# Altium schematic sheet Radio.SchDoc
size B; SheetNumber: 3; SheetTotal: 3
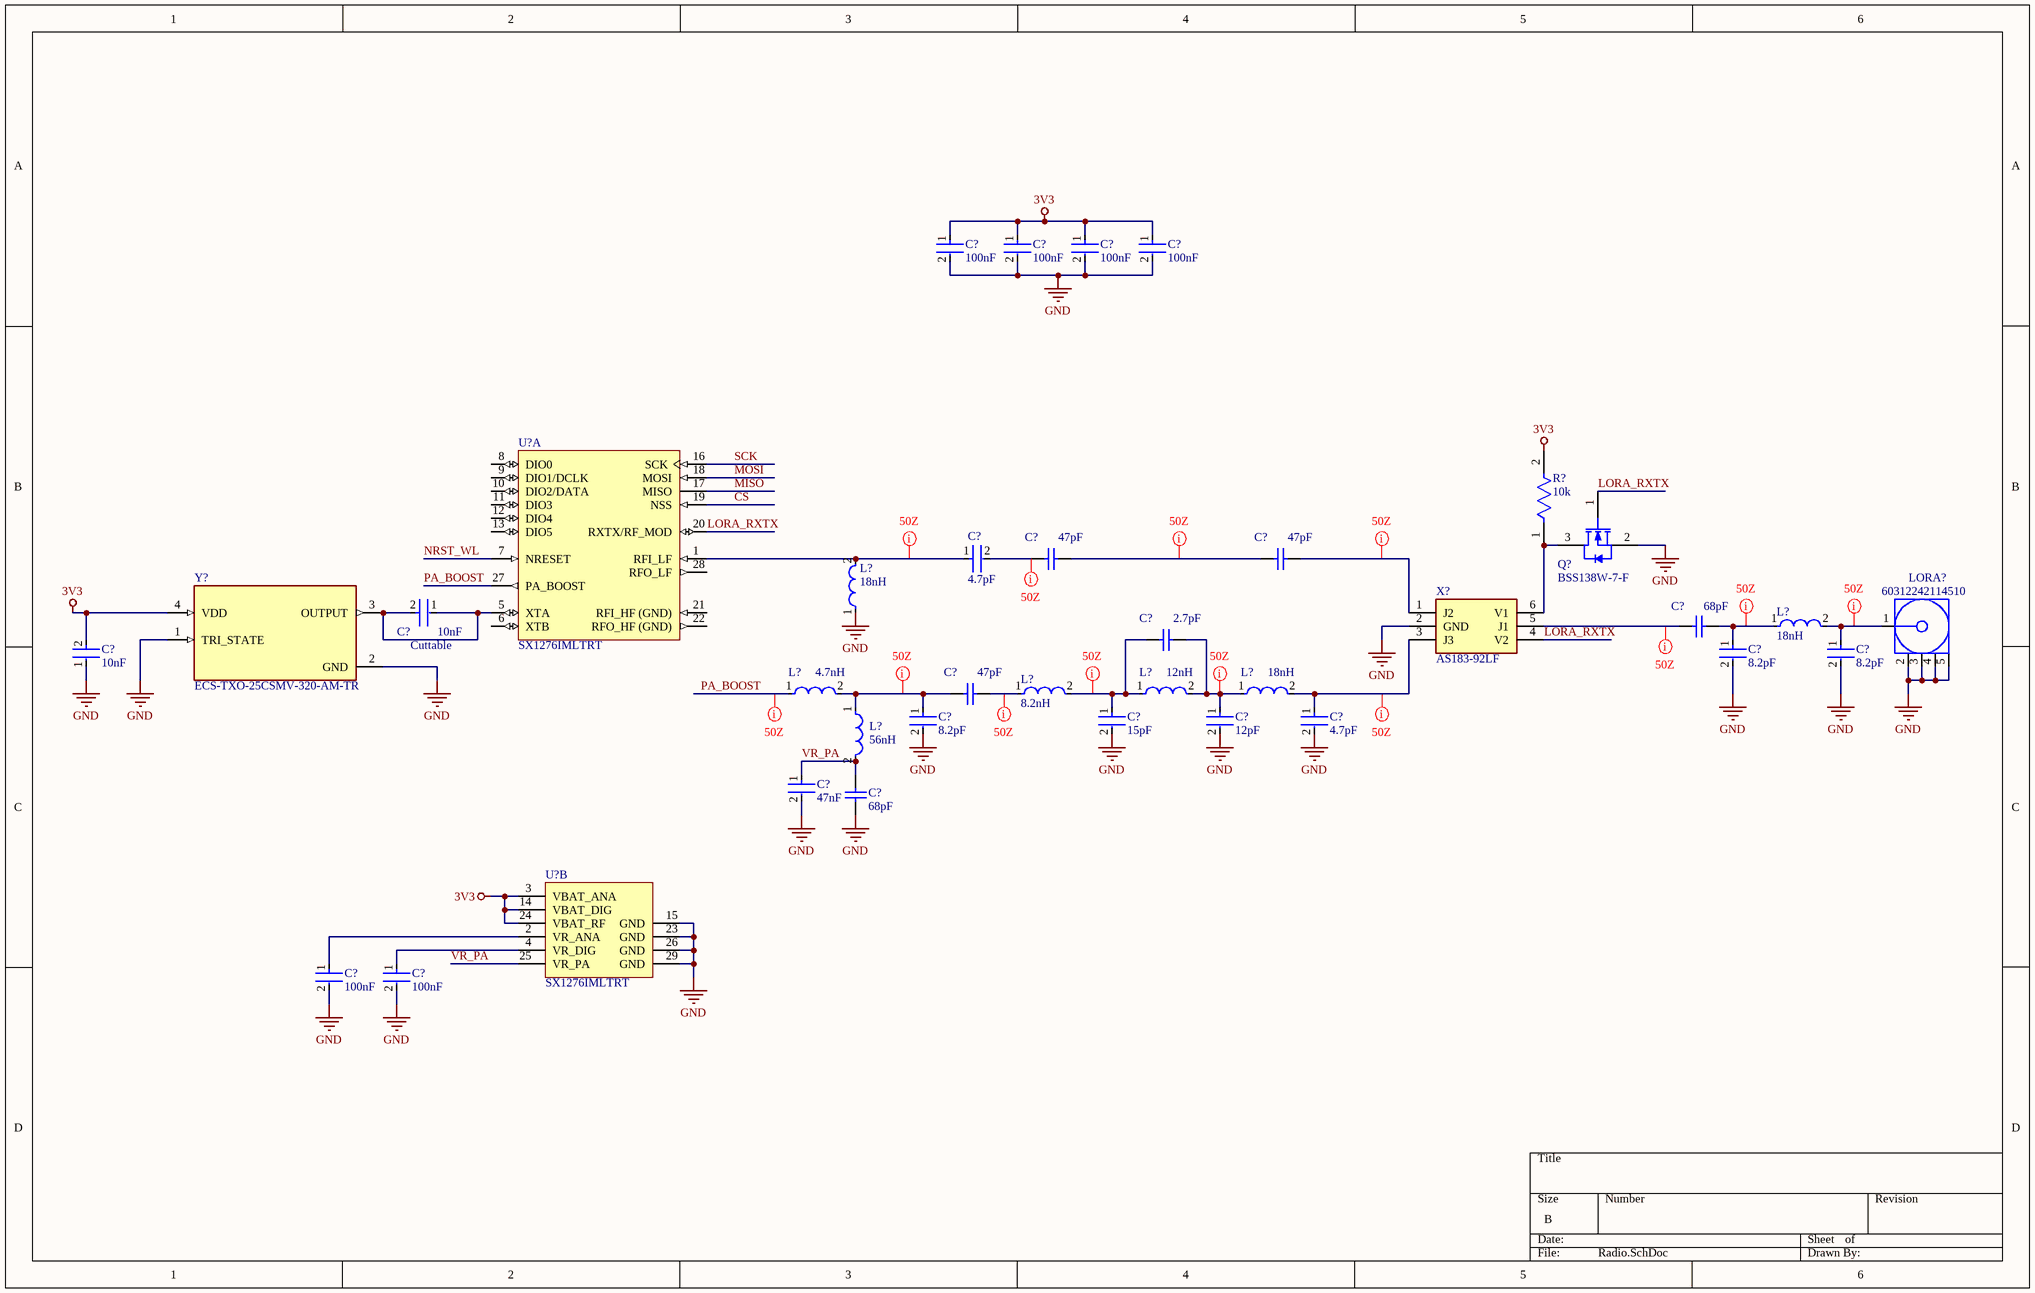
[diagram p0: Radio.SchDoc]

## Parts
(Parts that share a designator on the sheet are numbered #1, #2 ... from top to bottom, then left to right.)
C?#1  100nF  [FP-C0603C-CF-MFG]
C?#2  100nF  [FP-C0603C-CF-MFG]
C?#3  100nF  [FP-C0603C-CF-MFG]
C?#4  100nF  [FP-C0603C-CF-MFG]
C?#5  47pF  [CAPC1005X55X25LL05T10]
C?#6  47pF  [CAPC1005X55X25LL05T10]
C?#7  4.7pF  [FP-GRM155-0_05-MFG]
C?#8  10nF  [FP-C1608-080-0_1-MFG]
C?#9  68pF  [CAPC1005X55X25ML05T10]
C?#10  2.7pF  [CAPC1005X55X25ML05T10]
C?#11  10nF  [FP-C1608-080-0_1-MFG]
C?#12  8.2pF  [FP-GJM155-0_05-MFG]
C?#13  8.2pF  [FP-GJM155-0_05-MFG]
C?#14  47pF  [CAPC1005X55X25LL05T10]
C?#15  8.2pF  [FP-GJM155-0_05-MFG]
C?#16  15pF  [FP-GJM155-0_05-MFG]
C?#17  12pF  [FP-GRM155-0_05-MFG]
C?#18  4.7pF  [FP-GRM155-0_05-MFG]
C?#19  47nF  [FP-GRM155-0_05-IPC_C]
C?#20  68pF  [CAPC1005X55X25ML05T10]
C?#21  100nF  [FP-C0603C-CF-MFG]
C?#22  100nF  [FP-C0603C-CF-MFG]
L?#1  18nH  [FP-LQW15AN_00-W0_6-0_1-MFG]
L?#2  18nH  [FP-LQW15AN_00-W0_6-0_1-MFG]
L?#3  4.7nH  [FP-LQW15AN_00-W0_6-0_1-MFG]
L?#4  8.2nH  [FP-LQW15AN_00-W0_6-0_1-MFG]
L?#5  12nH  [FP-LQW15AN_00-W0_6-0_1-MFG]
L?#6  18nH  [FP-LQW15AN_00-W0_6-0_1-MFG]
L?#7  56nH  [FP-LQW15AN_80-MFG]
LORA?  60312242114510  [60312242114510]
Q?  BSS138W-7-F  [DIOD-SOT323-3_V]
R?  10k  [FP-RT0603-MFG]
U?#1  SX1276IMLTRT  [SMTC-QFN-28_V]  (part A of 2)
U?#2  SX1276IMLTRT  [SMTC-QFN-28_V]  (part B of 2)
X?  AS183-92LF  [SOT65P220X110-6N]
Y?  ECS-TXO-25CSMV-320-AM-TR  [OSC_ECS-2520S25-250-FN-TR]

## Nets
3V3: C?#1.1 C?#2.1 C?#3.1 C?#4.1 C?#11.2 R?.2 U?#2.3(VBAT_ANA) U?#2.14(VBAT_DIG) U?#2.24(VBAT_RF) Y?.4(VDD)
GND: C?#1.2 C?#2.2 C?#3.2 C?#4.2 C?#11.1 C?#12.2 C?#13.2 C?#15.2 C?#16.2 C?#17.2 C?#18.2 C?#19.2 C?#20.1 C?#21.2 C?#22.2 L?#1.1 LORA?.2(GND) LORA?.3(GND) LORA?.4(GND) LORA?.5(GND) Q?.2(S) U?#2.15(GND) U?#2.23(GND) U?#2.26(GND) U?#2.29(GND) X?.2(GND) Y?.1(TRI_STATE) Y?.2(GND)
CS: U?#1.19(NSS)
LORA_RXTX: Q?.1(G) U?#1.20(RXTX/RF_MOD) X?.4(V2)
MISO: U?#1.17(MISO)
MOSI: U?#1.18(MOSI)
NRST_WL: U?#1.7(NRESET)
PA_BOOST: L?#3.1 U?#1.27(PA_BOOST)
SCK: U?#1.16(SCK)
VR_PA: C?#19.1 C?#20.2 L?#7.2 U?#2.25(VR_PA)
NetC?#5_1: C?#5.1 C?#7.2
NetC?#5_2: C?#5.2 C?#6.1
NetC?#6_2: C?#6.2 X?.1(J2)
NetC?#7_1: C?#7.1 L?#1.2 U?#1.1(RFI_LF)
NetC?#8_1: C?#8.1 C?#8.2 U?#1.5(XTA) Y?.3(OUTPUT)
NetC?#9_1: C?#9.1 X?.5(J1)
NetC?#9_2: C?#9.2 C?#12.1 L?#2.1
NetC?#10_1: C?#10.1 C?#16.1 L?#4.2 L?#5.1
NetC?#10_2: C?#10.2 C?#17.1 L?#5.2 L?#6.1
NetC?#13_1: C?#13.1 L?#2.2 LORA?.1(Signal)
NetC?#14_1: C?#14.1 C?#15.1 L?#3.2 L?#7.1
NetC?#14_2: C?#14.2 L?#4.1
NetC?#18_1: C?#18.1 L?#6.2 X?.3(J3)
NetC?#21_1: C?#21.1 U?#2.2(VR_ANA)
NetC?#22_1: C?#22.1 U?#2.4(VR_DIG)
NetQ?_3: Q?.3(D) R?.1 X?.6(V1)

Not connected (* = marked no-connect by the designer): U?#1 6(XTB) 8(DIO0) 9(DIO1/DCLK) 10(DIO2/DATA) 11(DIO3) 12(DIO4) 13(DIO5) 21(RFI_HF_(GND)) 22(RFO_HF_(GND)) 28(RFO_LF)

## Layout directives
net class 50Z; rule Width Constraint [Pref Impedance = 50.00ohms    Min Impedance = 50.00ohms    Max Impedance = 50.00ohms]: NetC?#5_1, NetC?#5_2, NetC?#6_2, NetC?#7_1, NetC?#9_1, NetC?#9_2, NetC?#10_1, NetC?#10_2, NetC?#13_1, NetC?#14_1, NetC?#14_2, NetC?#18_1, PA_BOOST

## Notes on the sheet
- (near C?#8) Cuttable

## Library data of the parts
C?#1-C?#4 C?#21 C?#22 = CMP-2006-03061-2: CAP CER 0.1UF 50V X7R 0603; Manufacturer: KEMET; Manufacturer Part Number: C0603C104K5RACTU; Tolerance: 0.1; Temperature Coefficient: 30ppm/°C; Material: Ceramic; Automotive Grade: Grade 1; Value: 0.10 μF; Temperature: -55°C to +125°C; RoHS: TRUE; Temperature Range High: +125°C; Lead Free: Yes; Octopart: https://octopart.com/c0603c104k5ractu-kemet-139244; Digikey Description: CAP CER 0.1UF 50V X7R 0603; Category: Cap; Package: C0603C-CF; ComponentLink2Description: Datasheet; Temperature Range Low: -55°C; Device Class L1: Passive Components; Voltage Rating: 50 V; Automotive: Yes; Device Class L3: Ceramic Capacitors; ComponentLink2URL: https://api.kemet.com/component-edge/download/datasheet/C0603C100J5GACAUTO.pdf; Capacitance: 0.10 μF; Device Class L2: Capacitors; Temperature Characteristic: X7R; Height: 0.87mm
C?#5 C?#6 C?#14 = CMP-2008-04367-1: Part Number: GRM1555C1H470GA01J; Manufacturer: Murata
C?#7 C?#18 = CMP-2008-04380-2: CAP CER 4.7PF 50V C0G/NP0 0402; Dielectric: C0G; Material: Ceramic; Packaging: Tape and Reel; RoHS Compliant: Yes; Package Quantity: 1; Min Operating Temperature: -55°C; Voltage Rating (DC): 50V; Radiation Hardening: No; Thickness: 0.022inch; Case Code (Imperial): 0402; Length: 1mm; Voltage Rating: 50V; Lead Free: Lead Free; Case Code (Metric): 1005; Mount: Surface Mount; Series: GRM; REACH SVHC: No SVHC; Height: 0.5mm; Width: 0.02inch; Voltage: 50V; Capacitance: 4.7pF; Case/Package: 0402; Construction: Flat; Depth: 0.5mm; Termination: SMD/SMT; Max Operating Temperature: 125°C
C?#8 C?#11 = CMP-08246-003501-1: Multilayer Ceramic Capacitors 10nF ±10% 100V X7R SMD 0603; Voltage: 100V; Dielectric: X7R; Mount: Surface Mount; Packaging: Tape and Reel; Case/Package: 0603; Tolerance: 10%; Resistor Type: Ceramic; Case Code (Metric): 1608; Lead Free: Lead Free; RoHS Compliant: Yes; Radiation Hardening: No; Depth: 0.8mm; Thickness: 0.037inch; Length: 1.6mm; Case Code (Imperial): 0603; REACH SVHC: No SVHC; Min Operating Temperature: -55°C; Voltage Rating (DC): 100V; Series: C; Max Operating Temperature: 125°C; Construction: Flat; Number of Pins: 2; Package Quantity: 1; Termination: SMD/SMT; Voltage Rating: 100V; Capacitance: 10nF; Height: 0.8mm; Width: 0.8mm; Weight: 7.1E-05oz
C?#9 C?#20 = CMP-2008-04405-1: Manufacturer: Murata; Part Number: GRM1555C1H680GA01D
C?#10 = CMP-2008-04326-1: Part Number: GRM1555C1H2R7BA01D; Manufacturer: Murata
C?#12 C?#13 C?#15 = CMP-2008-03887-2: Multi-Layer Ceramic Capacitor 8.2pF C0G  ±0.05pF 0402 Paper T/R; Voltage Rating (DC): 50V; Termination: SMD/SMT; Packaging: Tape and Reel; Case Code (Imperial): 0402; Min Operating Temperature: -55°C; Mount: Surface Mount; Case Code (Metric): 1005; Height: 0.5mm; Length: 1mm; Dielectric: C0G; Max Operating Temperature: 125°C; Voltage Rating: 50V; Case/Package: 0402; Package Quantity: 10000; Depth: 0.5mm; Radiation Hardening: No; Width: 0.02inch; Capacitance: 8.2pF; Thickness: 0.022inch
C?#16 = CMP-2008-03803-2: Multi-Layer Ceramic Capacitor 15pF C0G  ±2% 0402 Paper T/R; Voltage Rating: 50V; Termination: SMD/SMT; Min Operating Temperature: -55°C; Case Code (Imperial): 0402; Depth: 0.5mm; Case/Package: 0402; Capacitance: 15pF; Max Operating Temperature: 125°C; Lead Free: Lead Free; Width: 0.02inch; Mount: Surface Mount; Radiation Hardening: No; Case Code (Metric): 1005; Length: 1mm; Height: 0.5mm; Package Quantity: 10000; Packaging: Tape and Reel; Voltage Rating (DC): 50V; Tolerance: 2%; Dielectric: C0G; Thickness: 0.022inch
C?#17 = CMP-2008-03945-2: CAP CER 12PF 50V C0G/NP0 0402; Tolerance: 2%; Dielectric: C0G; Material: Ceramic; Termination: SMD/SMT; Mount: Surface Mount; REACH SVHC: No SVHC; Depth: 0.5mm; Case Code (Metric): 1005; Voltage Rating: 50V; Height: 0.5mm; Voltage Rating (DC): 50V; Case Code (Imperial): 0402; Package Quantity: 10000; Construction: Flat; Thickness: 0.022inch; Length: 1mm; Min Operating Temperature: -55°C; Width: 0.5mm; Lead Free: Lead Free; Capacitance: 12pF; Case/Package: 0402; Packaging: Tape and Reel; Series: GRM; Voltage: 50V; Radiation Hardening: No; Max Operating Temperature: 125°C
C?#19 = CMP-2008-04032-2: Chip Multilayer Ceramic Capacitors for General Purpose, 0402, 47000pF, X7R, 15%, 10%, 25V; Max Operating Temperature: 125°C; Case/Package: 0402; Length: 1mm; Packaging: Tape and Reel; Mount: Surface Mount; Voltage Rating (DC): 25V; Voltage Rating: 25V; Termination: SMD/SMT; Case Code (Imperial): 0402; Depth: 0.5mm; Tolerance: 10%; Package Quantity: 50000; Width: 0.02inch; Height: 0.5mm; Capacitance: 47nF; Case Code (Metric): 1005; Radiation Hardening: No; Dielectric: X7R; Min Operating Temperature: -55°C; Thickness: 0.022inch
L?#1 L?#6 = CMP-06042-006916-1: Wire Wound RF Inductor 18nH ±5% 370mA 0.27Ω 0402 (1005); Q Factor: 25; DC Resistance (DCR): 270mR; Test Frequency: 100MHz; Self Resonant Frequency: 4.5GHz; Core Material: Air; Shielding: Unshielded; Inductance: 18nH; Lead Free: Lead Free; Resistor Type: Wirewound; Height: 0.5mm; Width: 0.02inch; Max DC Current: 370mA; Case/Package: 0402; Radiation Hardening: No; Min Operating Temperature: -55°C; Packaging: Tape and Reel; DC Current: 370mA; Tolerance: 5%; Max Operating Temperature: 125°C; Weight: 2.8E-05oz; Current Rating: 370mA; Military Standard: Not; Termination: SMD/SMT; Length: 1mm; Case Code (Metric): 1005; Mount: Surface Mount; Case Code (Imperial): 0402; Package Quantity: 10000; Depth: 0.7mm
L?#2 = CMP-06042-009767-1: Wire Wound RF Inductor 18nH ±2% 370mA 0.27Ω 0402 (1005); Self Resonant Frequency: 4.5GHz; DC Resistance (DCR): 270mR; Test Frequency: 100MHz; Q Factor: 25; Current: 280mA; Shielding: Unshielded; Core Material: Air; Length: 1mm; Lead Free: Lead Free; Termination: SMD/SMT; Width: 0.5mm; Inductance Tolerance: 2%; REACH SVHC: No SVHC; Radiation Hardening: No; Max DC Current: 370mA; Case/Package: 0402; Max Operating Temperature: 125°C; Mount: Surface Mount; Packaging: Tape and Reel; Case Code (Metric): 1005; Min Operating Temperature: -55°C; Depth: 0.7mm; Package Quantity: 10000; Military Standard: Not; Height - Seated (Max): 0.024inch; Weight: 2.8E-05oz; Case Code (Imperial): 0402; Number of Pins: 2; Resistor Type: Wirewound; Height: 0.5mm; Tolerance: 2%; Inductance: 18nH; DC Current: 370mA; Current Rating: 370mA
L?#3 = CMP-06042-009351-1: Wire Wound RF Inductor 4.7nH ±0.1nH 750mA 0.07Ω 0402 (1005); Self Resonant Frequency: 8GHz; Tolerance: 2%; Core Material: Air; Test Frequency: 100MHz; DC Resistance (DCR): 70mR; Q Factor: 25; Current: 140mA; Shielding: Unshielded; Case Code (Metric): 1005; Packaging: Tape and Reel; Max DC Current: 750mA; Max Operating Temperature: 125°C; Inductance: 4.7nH; Height: 0.5mm; Length: 1mm; DC Current: 750mA; Case/Package: 0402; Termination: SMD/SMT; Depth: 0.7mm; Radiation Hardening: No; Military Standard: Not; Current Rating: 750mA; Mount: Surface Mount; Package Quantity: 10000; Min Operating Temperature: -55°C; Lead Free: Lead Free; Weight: 2.8E-05oz; REACH SVHC: No SVHC; Width: 0.02inch; Case Code (Imperial): 0402
L?#4 = CMP-06042-008217-1: Wire Wound RF Inductor 8.2nH ±3% 540mA 0.14Ω 0402 (1005); Q Factor: 25; DC Resistance (DCR): 140mR; Core Material: Non-Magnetic; Shielding: Unshielded; Test Frequency: 100MHz; Self Resonant Frequency: 5.5GHz; Height: 0.5mm; Termination: SMD/SMT; Length: 1mm; Case Code (Metric): 1005; Case Code (Imperial): 0402; Inductance: 8.2nH; Max DC Current: 540mA; Width: 0.5mm; Resistor Type: Wirewound; Min Operating Temperature: -55°C; Weight: 2.8E-05oz; Height - Seated (Max): 0.024inch; Current Rating: 540mA; Case/Package: 0402; Radiation Hardening: No; Depth: 0.7mm; Package Quantity: 10000; Mount: Surface Mount; Packaging: Tape and Reel; DC Current: 540mA; Max Operating Temperature: 125°C; Military Standard: Not; Tolerance: 3%
L?#5 = CMP-06042-004254-1: Wire Wound RF Inductor 12nH ±3% 500mA 0.14Ω 0402 (1005); Test Frequency: 100MHz; Shielding: Unshielded; Current: 370mA; Q Factor: 30; DC Resistance (DCR): 140mR; Core Material: Air; Self Resonant Frequency: 5.5GHz; Weight: 2.8E-05oz; Mount: Surface Mount; Min Operating Temperature: -55°C; Case Code (Metric): 1005; Package Quantity: 10000; Resistor Type: Wirewound; Height: 0.5mm; Lead Free: Lead Free; Military Standard: Not; Depth: 0.7mm; Max Operating Temperature: 125°C; Case/Package: 0402; Length: 1mm; Packaging: Tape and Reel; DC Current: 500mA; Radiation Hardening: No; Inductance: 12nH; Current Rating: 500mA; Case Code (Imperial): 0402; Termination: SMD/SMT; Tolerance: 3%; Height - Seated (Max): 0.024inch; Max DC Current: 500mA; Width: 0.5mm
L?#7 = CMP-06042-015711-1: Wire Wound RF Inductor 56nH ±2% 340mA 0.996Ω 0402 (1005); Core Material: Non-Magnetic; Q Factor: 25; Shielding: Unshielded; Test Frequency: 100MHz; DC Resistance (DCR): 996mR; Self Resonant Frequency: 2.9GHz; Package Quantity: 1; Termination: SMD/SMT; Current Rating: 340mA; Case Code (Imperial): 0402; Mount: Surface Mount; Min Operating Temperature: -55°C; Height - Seated (Max): 0.024inch; Packaging: Tape and Reel; Width: 0.5mm; Resistor Type: Wirewound; Max Operating Temperature: 125°C; Tolerance: 2%; Inductance: 56nH; Case/Package: 0402; Length: 0.039inch; Max DC Current: 340mA; Height: 0.5mm; Case Code (Metric): 1005
LORA? = CMP-03913-97004434-2: 60312242114510 Rf Coax Conn, Sma Jack, 50 Ohm, Pcb Rohs Compliant: Yes; Insulation Resistance: 5GΩ; Impedance: 50Ω; Insertion Loss (dB): 0.14dB; Insulation Material: PTFE; Max Operating Temperature: 165°C; Orientation: Straight; NexarPartId: 97004434; Min Operating Temperature: -65°C; Connector Type: SMA
Q? = CMP-2000-05968-1: N-Channel Enhancement Mode Mosfet, 50 V, 200 mA, -55 to 150 degC, 6-Pin SOT-323, RoHS, Tape and Reel; Typical Turn-Off Delay Time: 20ns; Number of Channels: 1Channel; Type: EnhancementModeFieldEffectTransistor; Brand: DiodesIncorporated; Vds - Drain-Source Breakdown Voltage: 75V; Vgs - Gate-Source Voltage: 20V; Rds On - Drain-Source Resistance: 1.4Ohms; Transistor Type: 1N-Channel; Configuration: Single; Unit Weight: 0.000212oz; Pd - Power Dissipation: 200mW; Id - Continuous Drain Current: 200mA; Forward Transconductance - Min: 0.1S; Manufacturer URL: http://www.diodes.com/; Series: BSS138; Package Description: 3-Pin Small Outline Transistor, Body 2 x 1.25 mm, Pitch 0.65 mm; Mounting Technology: SurfaceMount; Product Category: MOSFET; RoHS: True; Maximum Operating Temperature: +150C; Height: 1mm; Length: 2.2mm; Technology: Si; Width: 1.35mm; Datasheet URL: http://www.diodes.com/_files/datasheets/ds30206.pdf; Manufacturer: DiodesIncorporated; Package / Case: SOT-323-3; Typical Turn-On Delay Time: 20ns; Transistor Polarity: N-Channel; Factory Pack Quantity: 3000; Packaging: Reel; Product: MOSFETSmallSignal; Datasheet Version: Rev. 11-2, 09/2013; Package Reference: SOT323; Minimum Operating Temperature: -55C; Mounting Style: SMD/SMT; Channel Mode: Enhancement
R? = CMP-2000-04517-2: RES SMD 10K OHM 0.1% 1/10W 0603; Manufacturer Part Number: RT0603BRE0710KL; Manufacturer: Yageo; Tolerance: 0.001; Temperature Coefficient: 50 ppm/°C; Power Rating: 0.1W; Resistance: 10KΩ; Value: 10KΩ; Voltage Rating: 75V; Temperature Range High: +155°C; Device Class L2: Resistors; Temperature: -55°C to +155°C; Series: RT; Device Class L1: Passive Components; Temperature Range Low: -55°C; Automotive: No; Mouser Description: Res Thin Film 0603 10K Ohm 0.1% 1/10W ±50ppm/°C Molded SMD SMD Paper T/R; Device Class L3: Chip SMD Resistors; RoHS: TRUE; Package: RT0603; Footprint Url: http://www.yageo.com/exep/pages/download/literatures/PYu-R_Mount_10.pdf; Octopart: https://octopart.com/rt0603bre0710kl-yageo-1273959; ComponentLink2URL: http://www.yageo.com/documents/recent/PYu-RT_1-to-0.01_RoHS_L_9.pdf; Composition: Thin Film; Category: Res; Lead Free: Yes; Height: 0.55mm; Digikey Description: RES SMD 10K OHM 0.1% 1/10W 0603; Ipc Land Pattern Name: RESC16080X45; ComponentLink2Description: Datasheet
U?#1 U?#2 = CMP-2000-05356-1: Low Power Long Range Transceiver, 137 to 1020 MHz, -40 to 85 degC, 28-Pin QFN, RoHS, Tape and Reel; Manufacturer: Semtech; Power - Output: 20dBm; Data Rate (Max): 300kbps; Sensitivity: -148dBm; Featured Product: SX1276LongRangeTransceiver; PCN Design/Specification: CopperWire25/Mar/2014; GPIO: 6; Frequency: 137MHz~1.02GHz; Voltage - Supply: 1.8V~3.7V; Protocol: LoRa™; Current - Transmitting: 20mA~120mA; Current - Receiving: 10.8mA~12mA; Online Catalog: SX1276,SX1277andSX1278; Design Resources: SX127xReferenceDesignOverviewDevelopmentToolSelector; Serial Interfaces: SPI; Mfg Application Notes: LoRaModulation:CrystalOscillatorGuidanceSX12xxSoftwareImplementationofDataWhiteningandCRCSX127xLoRaLowEnergyDesignGuideSX127xLoRaModemDesignersGuide; Modulation: FSK,GFSK,GMSK,MSK,OOK; Other Names: SX1276IMLTRTTR; Series: -; Manufacturer URL: http://www.semtech.com/; Datasheet URL: http://www.semtech.com/images/datasheet/sx1276.pdf; Type: TxRx+MCU; RF Family/Standard: 802.15.4; Package Reference: QFN-28; Standard Package: 3,000; Package Description: 28-Pin Quad Flat No-lead Package, Body 6 x 6 mm, Pitch 0.65 mm; Category: RF/IFandRFID; Operating Temperature: -40degC~85degC; Datasheet Version: Rev. 4, 03/2015; Memory Size: -; Family: RFTransceiverICs; Packaging: Tape&Reel(TR); Package / Case: 28-VQFNExposedPad
X? = CMP-011-00014-1: RF Switch ICs .3-2500MHz IL .3dB IP3 +43dBm; Manufacturer_Name: Skyworks; Geometry.Height: 1.1mm; Source: AS183-92LF.SchLib; Design Item ID: AS183-92LF; Datasheet Link: https://www.skyworksinc.com/-/media/SkyWorks/Documents/Products/1-100/200177D.pdf; Mouser Part Number: 873-AS183-92LF; Manufacturer_Part_Number: AS183-92LF; Mouser Price/Stock: https://www.mouser.co.uk/ProductDetail/Skyworks-Solutions-Inc/AS183-92LF?qs=WMHGlxXAKT9uKJ5iI33IgQ%3D%3D
Y? = ECS-TXO-25CSMV-320-AM-TR: miniature SMD HCMOS Tight Stability Crystal Oscillator; MF: {'manufacturer': u'ECS Inc.'}; Package: None; Price: None; Value: *; MP: ECS-TXO-25CSMV-320-AM-TR; Availability: Unavailable; Supplier 1: Newark; Supplier Part Number 1: 69AK8445